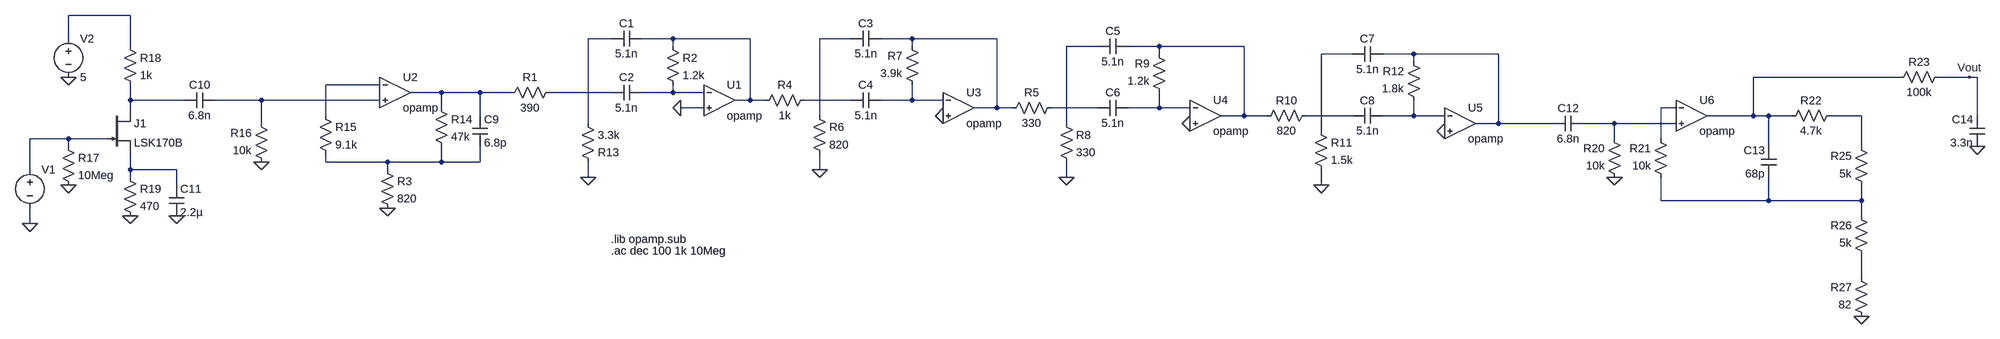
[diagram p0: schematic Rx filter.asc]
Rx filter.asc, the LTspice schematic file:
Version 4
SHEET 1 2664 896
WIRE -1216 64 -1344 64
WIRE -1344 112 -1344 64
WIRE -192 112 -240 112
WIRE -64 112 -128 112
WIRE 96 112 -64 112
WIRE 304 112 240 112
WIRE 432 112 368 112
WIRE 608 112 432 112
WIRE -1216 128 -1216 64
WIRE -64 128 -64 112
WIRE 432 128 432 112
WIRE 816 128 752 128
WIRE 944 128 880 128
WIRE 1120 128 944 128
WIRE 944 144 944 128
WIRE 1344 144 1280 144
WIRE 1472 144 1408 144
WIRE 1648 144 1472 144
WIRE 1472 160 1472 144
WIRE 2480 192 2176 192
WIRE 2624 192 2560 192
WIRE 2640 192 2624 192
WIRE -672 208 -784 208
WIRE -544 224 -608 224
WIRE -464 224 -544 224
WIRE -400 224 -464 224
WIRE -192 224 -320 224
WIRE -64 224 -64 208
WIRE -64 224 -128 224
WIRE 0 224 -64 224
WIRE -1216 240 -1216 208
WIRE -1104 240 -1216 240
WIRE -944 240 -1040 240
WIRE -672 240 -944 240
WIRE 96 240 96 112
WIRE 96 240 64 240
WIRE 128 240 96 240
WIRE 304 240 208 240
WIRE 432 240 432 208
WIRE 432 240 368 240
WIRE 496 240 432 240
WIRE -1216 256 -1216 240
WIRE -544 256 -544 224
WIRE 0 256 -48 256
WIRE 608 256 608 112
WIRE 608 256 560 256
WIRE 640 256 608 256
WIRE 816 256 720 256
WIRE 944 256 944 224
WIRE 944 256 880 256
WIRE 1008 256 944 256
WIRE 2016 256 1984 256
WIRE -784 272 -784 208
WIRE -464 272 -464 224
WIRE 240 272 240 112
WIRE 1120 272 1120 128
WIRE 1120 272 1072 272
WIRE 1168 272 1120 272
WIRE 1344 272 1248 272
WIRE 1472 272 1472 240
WIRE 1472 272 1408 272
WIRE 1536 272 1472 272
WIRE 2176 272 2176 192
WIRE 2176 272 2080 272
WIRE 2208 272 2176 272
WIRE 2256 272 2208 272
WIRE 2400 272 2336 272
WIRE 2640 272 2640 192
WIRE -944 288 -944 240
WIRE -240 288 -240 112
WIRE 752 288 752 128
WIRE 1648 288 1648 144
WIRE 1648 288 1600 288
WIRE 1760 288 1648 288
WIRE 1888 288 1824 288
WIRE 2016 288 1888 288
WIRE 1280 304 1280 144
WIRE -1344 320 -1424 320
WIRE -1264 320 -1344 320
WIRE 1888 320 1888 288
WIRE 1984 320 1984 256
WIRE -1344 336 -1344 320
WIRE 2208 336 2208 272
WIRE 2400 336 2400 272
WIRE -784 368 -784 352
WIRE -656 368 -784 368
WIRE -544 368 -544 336
WIRE -544 368 -656 368
WIRE -464 368 -464 336
WIRE -464 368 -544 368
WIRE -1424 384 -1424 320
WIRE -1216 384 -1216 352
WIRE -1120 384 -1216 384
WIRE -656 384 -656 368
WIRE 240 384 240 352
WIRE -1216 400 -1216 384
WIRE -240 400 -240 368
WIRE 752 400 752 368
WIRE -1120 416 -1120 384
WIRE 1280 416 1280 384
WIRE 1984 448 1984 400
WIRE 2208 448 2208 400
WIRE 2208 448 1984 448
WIRE 2400 448 2400 416
WIRE 2400 448 2208 448
WIRE 2400 480 2400 448
WIRE -1424 496 -1424 464
WIRE 2400 608 2400 560
FLAG -1424 496 0
FLAG -240 400 0
FLAG -48 256 0
FLAG 240 384 0
FLAG 496 272 0
FLAG 752 400 0
FLAG 1008 288 0
FLAG 1280 416 0
FLAG 1536 304 0
FLAG -944 368 0
FLAG -656 464 0
FLAG -1344 416 0
FLAG -1344 192 0
FLAG -1216 480 0
FLAG -1120 480 0
FLAG 2400 688 0
FLAG 1888 400 0
FLAG 2640 336 0
FLAG 2624 192 Vout
SYMBOL voltage -1424 368 R0
SYMATTR InstName V1
SYMATTR Value ""
SYMATTR Value2 AC 1
SYMBOL Res -304 208 R90
WINDOW 0 0 56 VBottom 2
WINDOW 3 32 56 VTop 2
SYMATTR InstName R1
SYMATTR Value 390
SYMBOL Res -256 272 R0
WINDOW 0 36 76 Left 2
WINDOW 3 36 40 Left 2
SYMATTR InstName R13
SYMATTR Value 3.3k
SYMBOL Cap -192 128 R270
WINDOW 0 32 32 VTop 2
WINDOW 3 0 32 VBottom 2
SYMATTR InstName C1
SYMATTR Value 5.1n
SYMBOL Cap -192 240 R270
WINDOW 0 32 32 VTop 2
WINDOW 3 0 32 VBottom 2
SYMATTR InstName C2
SYMATTR Value 5.1n
SYMBOL Res -80 112 R0
SYMATTR InstName R2
SYMATTR Value 1.2k
SYMBOL opamp 32 176 R0
SYMATTR InstName U1
SYMBOL Res 224 224 R90
WINDOW 0 0 56 VBottom 2
WINDOW 3 32 56 VTop 2
SYMATTR InstName R4
SYMATTR Value 1k
SYMBOL Res 224 256 R0
SYMATTR InstName R6
SYMATTR Value 820
SYMBOL Cap 368 96 R90
WINDOW 0 0 32 VBottom 2
WINDOW 3 32 32 VTop 2
SYMATTR InstName C3
SYMATTR Value 5.1n
SYMBOL Res 448 224 R180
WINDOW 0 36 76 Left 2
WINDOW 3 36 40 Left 2
SYMATTR InstName R7
SYMATTR Value 3.9k
SYMBOL Cap 368 224 R90
WINDOW 0 0 32 VBottom 2
WINDOW 3 32 32 VTop 2
SYMATTR InstName C4
SYMATTR Value 5.1n
SYMBOL opamp 528 192 R0
SYMATTR InstName U3
SYMBOL Res 736 240 R90
WINDOW 0 0 56 VBottom 2
WINDOW 3 32 56 VTop 2
SYMATTR InstName R5
SYMATTR Value 330
SYMBOL Res 736 272 R0
SYMATTR InstName R8
SYMATTR Value 330
SYMBOL Cap 880 112 R90
WINDOW 0 0 32 VBottom 2
WINDOW 3 32 32 VTop 2
SYMATTR InstName C5
SYMATTR Value 5.1n
SYMBOL Res 960 240 R180
WINDOW 0 36 76 Left 2
WINDOW 3 36 40 Left 2
SYMATTR InstName R9
SYMATTR Value 1.2k
SYMBOL Cap 880 240 R90
WINDOW 0 0 32 VBottom 2
WINDOW 3 32 32 VTop 2
SYMATTR InstName C6
SYMATTR Value 5.1n
SYMBOL opamp 1040 208 R0
SYMATTR InstName U4
SYMBOL Res 1264 256 R90
WINDOW 0 0 56 VBottom 2
WINDOW 3 32 56 VTop 2
SYMATTR InstName R10
SYMATTR Value 820
SYMBOL Res 1264 288 R0
SYMATTR InstName R11
SYMATTR Value 1.5k
SYMBOL Cap 1408 128 R90
WINDOW 0 0 32 VBottom 2
WINDOW 3 32 32 VTop 2
SYMATTR InstName C7
SYMATTR Value 5.1n
SYMBOL Res 1488 256 R180
WINDOW 0 36 76 Left 2
WINDOW 3 36 40 Left 2
SYMATTR InstName R12
SYMATTR Value 1.8k
SYMBOL Cap 1408 256 R90
WINDOW 0 0 32 VBottom 2
WINDOW 3 32 32 VTop 2
SYMATTR InstName C8
SYMATTR Value 5.1n
SYMBOL opamp 1568 224 R0
SYMATTR InstName U5
SYMBOL opamp -640 160 R0
SYMATTR InstName U2
SYMBOL Res -560 240 R0
SYMATTR InstName R14
SYMATTR Value 47k
SYMBOL Cap -480 272 R0
SYMATTR InstName C9
SYMATTR Value 6.8p
SYMBOL Res -672 368 R0
SYMATTR InstName R3
SYMATTR Value 820
SYMBOL Res -800 256 R0
SYMATTR InstName R15
SYMATTR Value 9.1k
SYMBOL Res -928 384 R180
WINDOW 0 36 76 Left 2
WINDOW 3 36 40 Left 2
SYMATTR InstName R16
SYMATTR Value 10k
SYMBOL Cap -1040 224 R90
WINDOW 0 0 32 VBottom 2
WINDOW 3 32 32 VTop 2
SYMATTR InstName C10
SYMATTR Value 6.8n
SYMBOL njf -1264 256 R0
SYMATTR InstName J1
SYMATTR Value LSK170B
SYMBOL Res -1360 320 R0
SYMATTR InstName R17
SYMATTR Value 10Meg
SYMBOL Res -1232 384 R0
SYMATTR InstName R19
SYMATTR Value 470
SYMBOL Cap -1136 416 R0
SYMATTR InstName C11
SYMATTR Value 2.2µ
SYMBOL Res -1232 112 R0
SYMATTR InstName R18
SYMATTR Value 1k
SYMBOL voltage -1344 96 R0
SYMATTR InstName V2
SYMATTR Value 5
SYMBOL opamp 2048 208 R0
SYMATTR InstName U6
SYMBOL Cap 1824 272 R90
WINDOW 0 0 32 VBottom 2
WINDOW 3 32 32 VTop 2
SYMATTR InstName C12
SYMATTR Value 6.8n
SYMBOL Res 1904 416 R180
WINDOW 0 36 76 Left 2
WINDOW 3 36 40 Left 2
SYMATTR InstName R20
SYMATTR Value 10k
SYMBOL Res 2000 416 R180
WINDOW 0 36 76 Left 2
WINDOW 3 36 40 Left 2
SYMATTR InstName R21
SYMATTR Value 10k
SYMBOL Cap 2224 400 R180
WINDOW 0 24 56 Left 2
WINDOW 3 24 8 Left 2
SYMATTR InstName C13
SYMATTR Value 68p
SYMBOL Res 2352 256 R90
WINDOW 0 0 56 VBottom 2
WINDOW 3 32 56 VTop 2
SYMATTR InstName R22
SYMATTR Value 4.7k
SYMBOL Res 2416 432 R180
WINDOW 0 36 76 Left 2
WINDOW 3 36 40 Left 2
SYMATTR InstName R25
SYMATTR Value 5k
SYMBOL Res 2416 576 R180
WINDOW 0 36 76 Left 2
WINDOW 3 36 40 Left 2
SYMATTR InstName R26
SYMATTR Value 5k
SYMBOL Res 2416 704 R180
WINDOW 0 36 76 Left 2
WINDOW 3 36 40 Left 2
SYMATTR InstName R27
SYMATTR Value 82
SYMBOL Res 2576 176 R90
WINDOW 0 0 56 VBottom 2
WINDOW 3 32 56 VTop 2
SYMATTR InstName R23
SYMATTR Value 100k
SYMBOL Cap 2656 336 R180
WINDOW 0 24 56 Left 2
WINDOW 3 24 8 Left 2
SYMATTR InstName C14
SYMATTR Value 3.3n
TEXT -192 528 Left 2 !.lib opamp.sub
TEXT -192 552 Left 2 !.ac dec 100 1k 10Meg

The netlist it stands for:
* Rx filter.asc
V1 N026 0 AC 1
R1 N013 N012 390
R13 N002 0 3.3k
C1 N002 N003 5.1n
C2 N013 N014 5.1n
R2 N003 N014 1.2k
XU1 N014 0 N003 opamp Aol=100K GBW=10Meg  ; pins invin noninvin out
R4 N017 N003 1k
R6 N004 0 820
C3 N005 N004 5.1n
R7 N018 N005 3.9k
C4 N018 N017 5.1n
XU3 N018 0 N005 opamp Aol=100K GBW=10Meg  ; pins invin noninvin out
R5 N019 N005 330
R8 N006 0 330
C5 N007 N006 5.1n
R9 N020 N007 1.2k
C6 N020 N019 5.1n
XU4 N020 0 N007 opamp Aol=100K GBW=10Meg  ; pins invin noninvin out
R10 N022 N007 820
R11 N008 0 1.5k
C7 N009 N008 5.1n
R12 N023 N009 1.8k
C8 N023 N022 5.1n
XU5 N023 0 N009 opamp Aol=100K GBW=10Meg  ; pins invin noninvin out
XU2 N011 N016 N012 opamp Aol=100K GBW=10Meg  ; pins invin noninvin out
R14 N012 N027 47k
C9 N012 N027 6.8p
R3 N027 0 820
R15 N011 N027 9.1k
R16 0 N016 10k
C10 N016 N015 6.8n
J1 N015 N026 N028 LSK170B
R17 N026 0 10Meg
R19 N028 0 470
C11 N028 0 2.2µ
R18 N001 N015 1k
V2 N001 0 5
XU6 N021 N025 N010 opamp Aol=100K GBW=10Meg  ; pins invin noninvin out
C12 N025 N009 6.8n
R20 0 N025 10k
R21 N029 N021 10k
C13 N029 N010 68p
R22 N024 N010 4.7k
R25 N029 N024 5k
R26 N030 N029 5k
R27 0 N030 82
R23 Vout N010 100k
C14 0 Vout 3.3n
.model NJF NJF
.model PJF PJF
.lib standard.jft
.lib opamp.sub
.ac dec 100 1k 10Meg
.backanno
.end